# EAGLE schematic SSB Transceiver_SA612 Mixer (EAGLE 9.4.2)
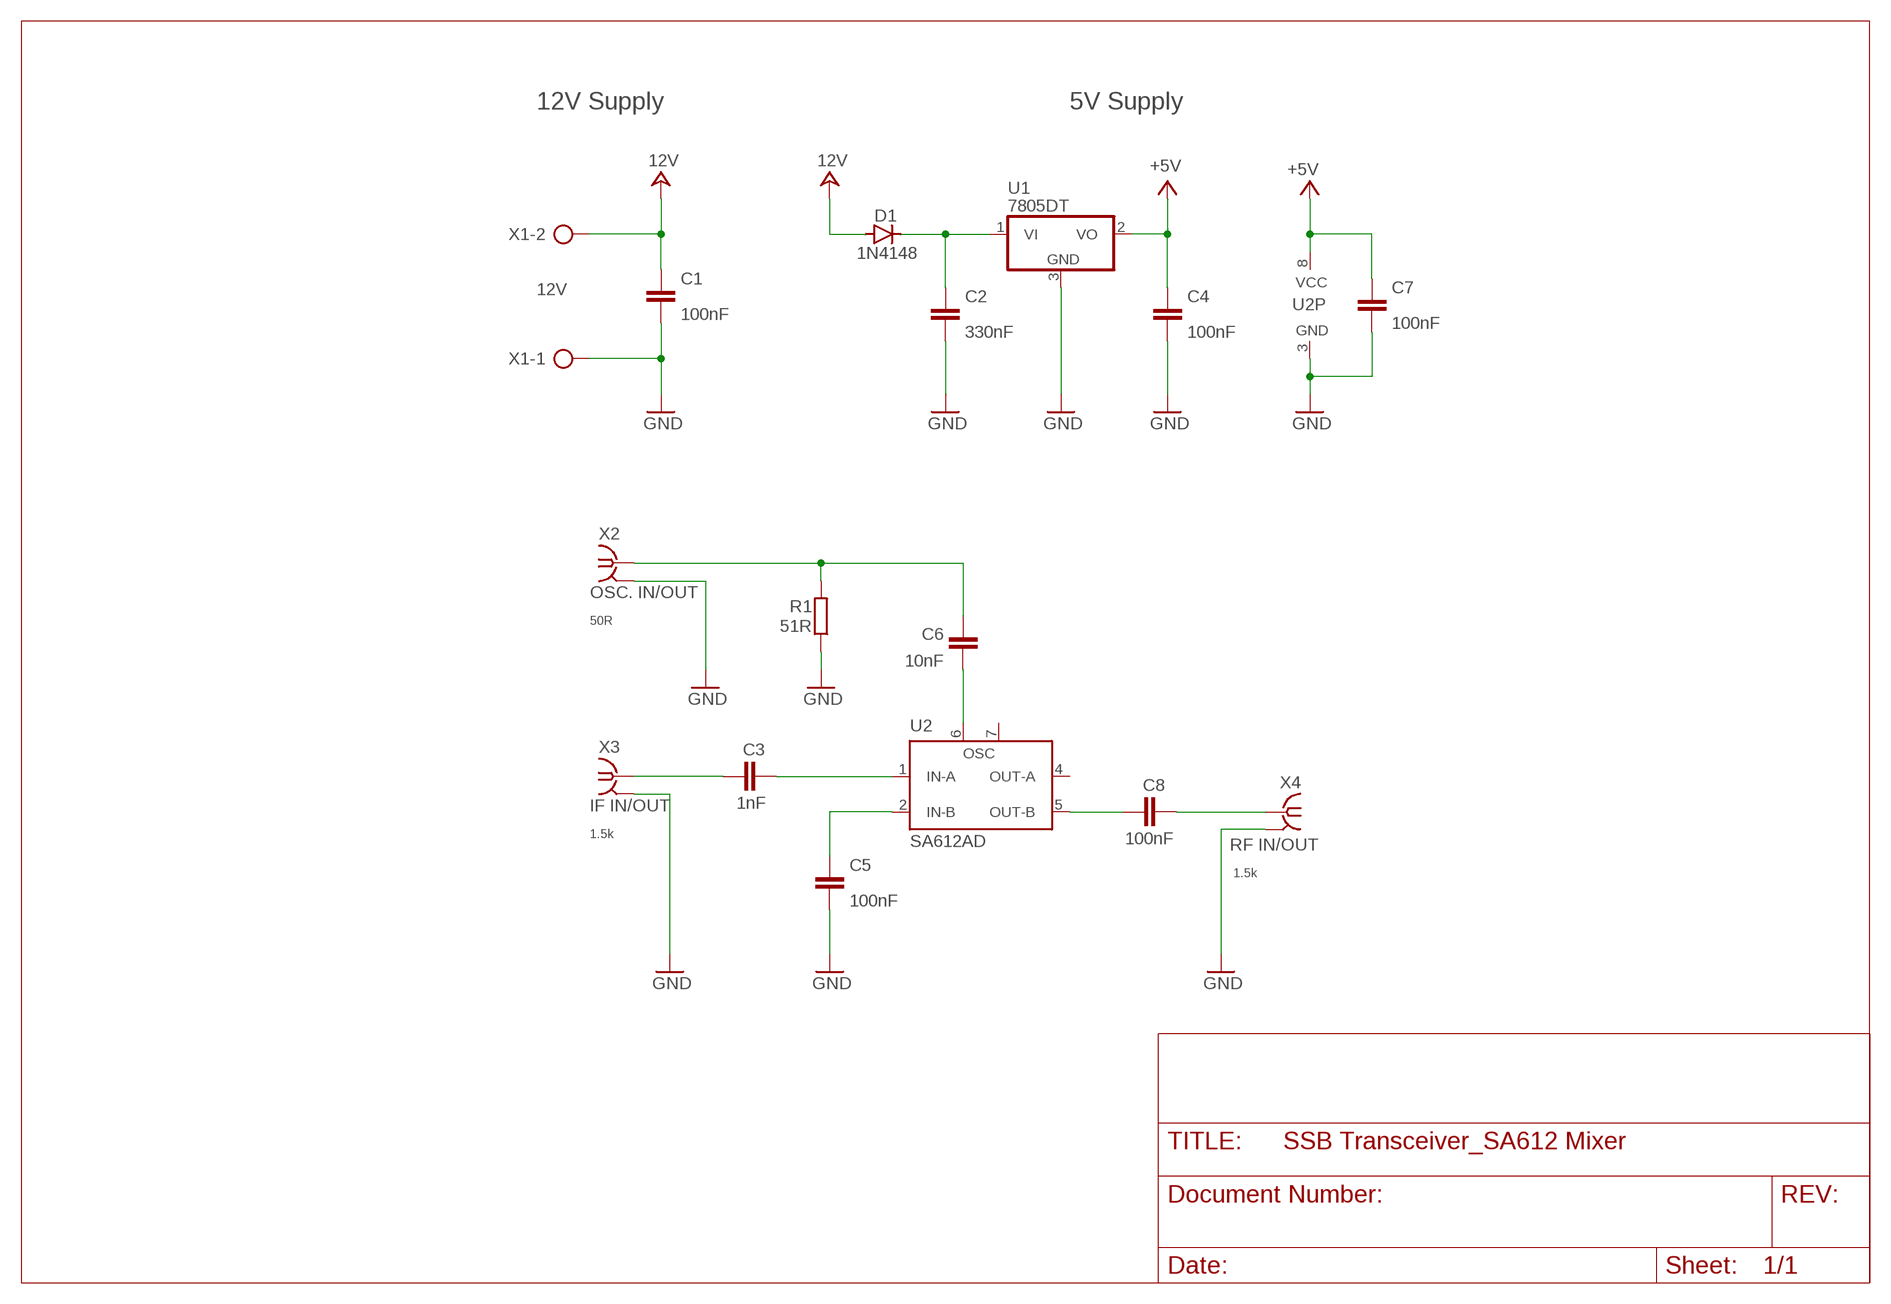
[diagram p0: schematic, sheet 1]

## Parts
C1  100nF  C-EUC0805  [C0805]
C2  330nF  C-EUC0805  [C0805]
C3  1nF  C-EUC0805  [C0805]
C4  100nF  C-EUC0805  [C0805]
C5  100nF  C-EUC0805  [C0805]
C6  10nF  C-EUC0805  [C0805]
C7  100nF  C-EUC0805  [C0805]
C8  100nF  C-EUC0805  [C0805]
D1  1N4148  DIODE-SOD323-W  [SOD323-W]
R1  51R  R-EU_M0805  [M0805]
U1  7805DT  [TO252]
U2  SA612AD  [SO08]
X1  12V  AK300/2  [AK300/2]
X2  OSC. IN/OUT  SMA-142-0711-821/826  [J502-ND-142-0711-821/826]
X3  IF IN/OUT  SMA-142-0711-821/826  [J502-ND-142-0711-821/826]
X4  RF IN/OUT  SMA-142-0711-821/826  [J502-ND-142-0711-821/826]

## Nets
+5V: C4.2 C7.2 U1.2(VO) U2.8(VCC)
+24V: C1.2 D1.A X1.2 ; supply symbol labelled 12V
GND: C1.1 C2.1 C4.1 C5.1 C7.1 R1.1 U1.3(GND) U2.3(GND) X1.1 X2.G@1 X2.G@2 X2.G@3 X2.G@4 X3.G@1 X3.G@2 X3.G@3 X3.G@4 X4.G@1 X4.G@2 X4.G@3 X4.G@4
N$1: C6.2 R1.2 X2.1
N$2: C8.1 X4.1
N$3: C5.2 U2.2(IN-B)
N$4: C3.2 X3.1
N$5: C3.1 U2.1(IN-A)
N$6: C6.1 U2.6(OSC)
N$7: C8.2 U2.5(OUT-B)
N$8: C2.2 D1.C U1.1(VI)
Unconnected: U2.4(OUT-A) U2.7(OSC')

## Notes on the sheet
- 12V Supply | 5V Supply
- 50R
- 1.5k
- 1.5k

## Library data of the parts
C1-C8 = rcl:C-EU: CAPACITOR, European symbol; SPICEPREFIX: C
D1 = diode:DIODE-: DIODE
R1 = rcl:R-EU_: RESISTOR, European symbol; SPICEPREFIX: R
U1 = linear:78*: Positive VOLTAGE REGULATOR Source: http://cache.national.com/ds/LM/LM78L05.pdf http://www.fairchildsemi.com/ds/LM/LM7805.pdf
U2 = Ham Radio:SA612A: Double-balanced mixer and oscillator NE612/SA612 Source: www-eu2.semiconductors.philips.com/acrobat/datasheets/SA612A.pdf
X1 = con-ptr500:AK300/2: CONNECTOR; OC_FARNELL: unknown; OC_NEWARK: unknown
X2-X4 = con-coax:SMA-: SMA 50 Ohm End Launch Jack Receptacle - Round Contact Johnson Components Source: www.johnsoncomponents.com .. J502-ND.pdf; MF: JOHNSON COMPONENTS; MPN: 142-0711-821; OC_FARNELL: 1019328; OC_NEWARK: 16F3627